# EAGLE board STM32 output card (EAGLE 9.5.1), part 1 of 2
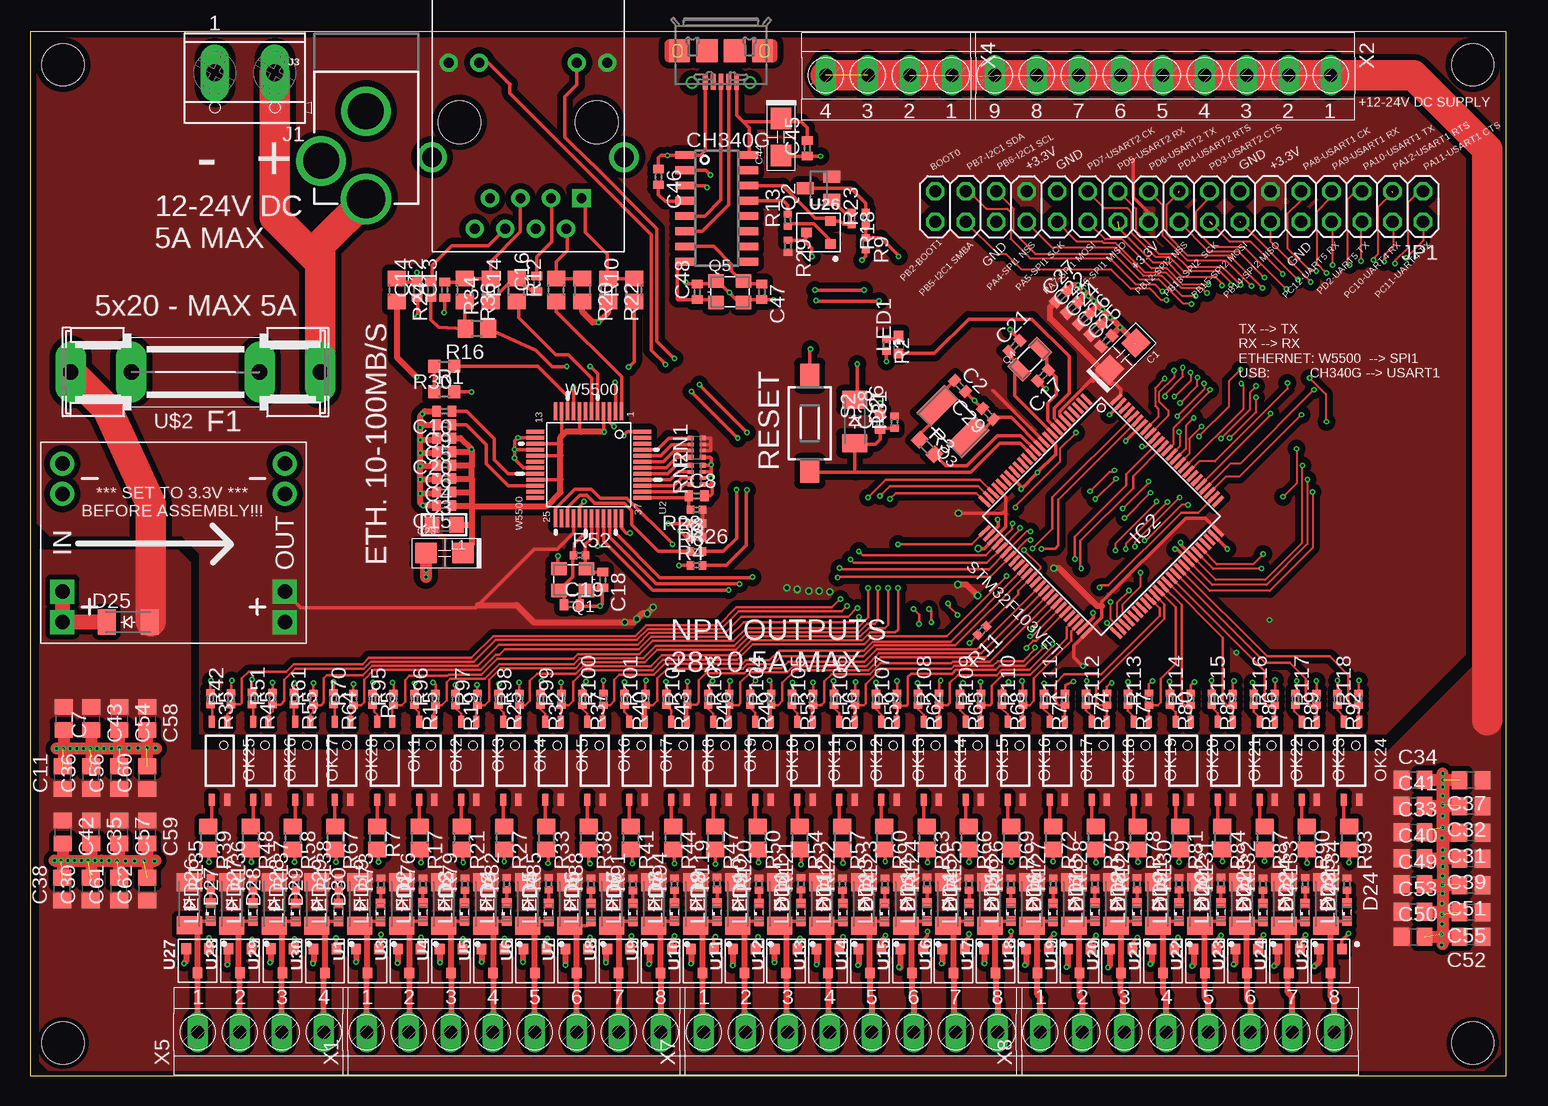
[diagram p7: board, top side]
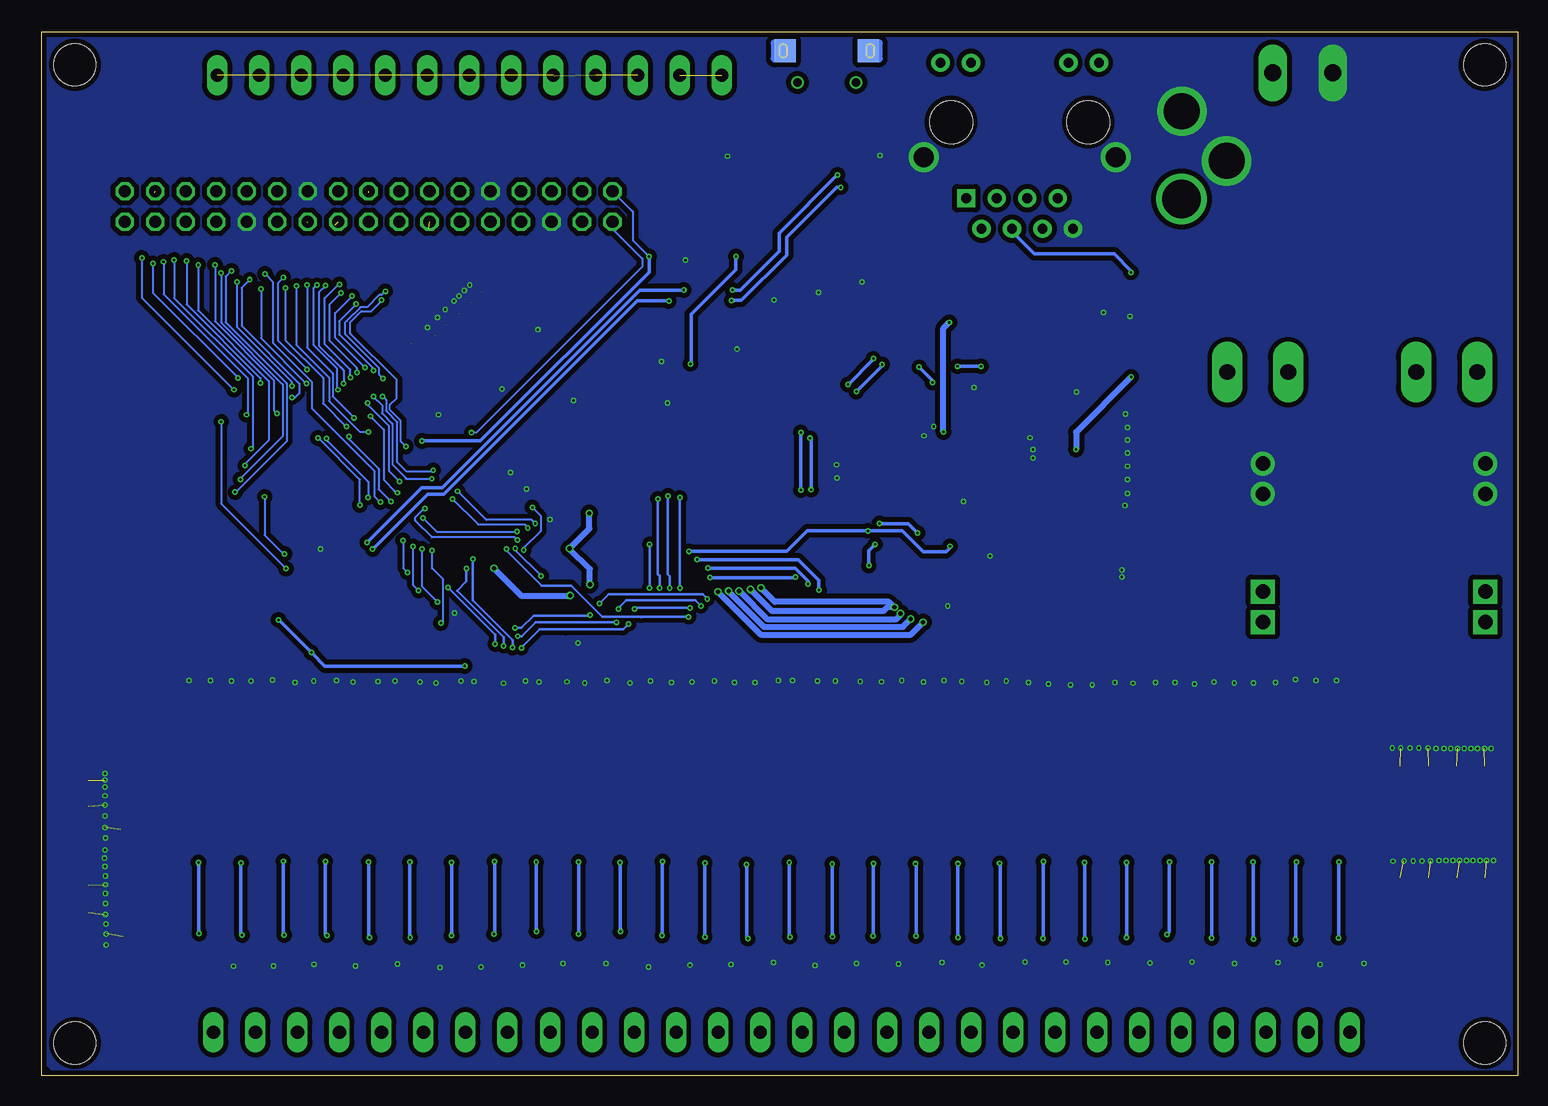
[diagram p8: board, bottom side, seen from below]

Size 123 x 87 mm. Coordinates in mm from the lower left corner, seen from the top.
Outline: 123,0 123,87 0,87 0,0 123,0
Copper layers (1*16): Top 0.035mm / dielectric 1.5mm / Bottom 0.035mm
Design rules "default *": minimum track width 5mil, minimum drill 0.2mm, track to track 5mil, track to pad 5mil, pad to pad 5mil, via to via 10mil, smd to smd 5mil, copper to edge 10mil, drill to drill 10mil, minimum pad ring 6mil, minimum via ring 5mil, stop-mask expansion 4mil, vias tented up to drill 20mil, thermal gap 6mil
Holes 3.5 mm at 120.24,84.25 2.75,84.25 2.74,2.74 120.24,2.74

## Footprints (pad centres in the part's own frame; a part is rotated, then mirrored left to right if it is on the bottom)
C-3216(TANTAL) = smd 1.8 x 1.7: 1 1.55,0; 2 -1.55,0
C0402 = smd 0.7 x 0.9: 1 -0.65,0; 2 0.65,0
C0805 = smd 1.3 x 1.5: 1 -0.95,0; 2 0.95,0
CON_USB_MICRO-B-3 = smd 1.73 x 1.9: B1 -3.463,-0.325; B4 3.463,-0.325 | smd 1.8 x 1.9: B2 -1.15,-0.325; B3 1.15,-0.325 | drill 0.7: B5 -2.425,2.325; B6 2.425,2.325 | smd 1.73 x 1.9 bottom: B7 -3.463,-0.325; B8 3.463,-0.325 | smd 0.4 x 1.35: P1 -1.3,2.25; P2 -0.65,2.25; P3 0,2.25; P4 0.65,2.25; P5 1.3,2.25
SOD-123_MINI-SMA = smd 1.5 x 2.1: A 1.8,0; C -1.8,0
SHK20L = drill 1.321 pad 2.54 long: 1A -10.414,0; 1B -5.334,0; 2A 10.414,0; 2B 5.334,0
LQFP100 = smd 0.3 x 1.2: 1 -6,-7.75; 2 -5.5,-7.75; 3 -5,-7.75; 4 -4.5,-7.75; 5 -4,-7.75; 6 -3.5,-7.75; 7 -3,-7.75; 8 -2.5,-7.75; 9 -2,-7.75; 10 -1.5,-7.75; 11 -1,-7.75; 12 -0.5,-7.75; 13 0,-7.75; 14 0.5,-7.75; 15 1,-7.75; 16 1.5,-7.75; 17 2,-7.75; 18 2.5,-7.75; 19 3,-7.75; 20 3.5,-7.75; 21 4,-7.75; 22 4.5,-7.75; 23 5,-7.75; 24 5.5,-7.75; 25 6,-7.75; 51 6,7.75; 52 5.5,7.75; 53 5,7.75; 54 4.5,7.75; 55 4,7.75; 56 3.5,7.75; 57 3,7.75; 58 2.5,7.75; 59 2,7.75; 60 1.5,7.75; 61 1,7.75; 62 0.5,7.75; 63 0,7.75; 64 -0.5,7.75; 65 -1,7.75; 66 -1.5,7.75; 67 -2,7.75; 68 -2.5,7.75; 69 -3,7.75; 70 -3.5,7.75; 71 -4,7.75; 72 -4.5,7.75; 73 -5,7.75; 74 -5.5,7.75; 75 -6,7.75 | smd 1.2 x 0.3: 26 7.75,-6; 27 7.75,-5.5; 28 7.75,-5; 29 7.75,-4.5; 30 7.75,-4; 31 7.75,-3.5; 32 7.75,-3; 33 7.75,-2.5; 34 7.75,-2; 35 7.75,-1.5; 36 7.75,-1; 37 7.75,-0.5; 38 7.75,0; 39 7.75,0.5; 40 7.75,1; 41 7.75,1.5; 42 7.75,2; 43 7.75,2.5; 44 7.75,3; 45 7.75,3.5; 46 7.75,4; 47 7.75,4.5; 48 7.75,5; 49 7.75,5.5; 50 7.75,6; 76 -7.75,6; 77 -7.75,5.5; 78 -7.75,5; 79 -7.75,4.5; 80 -7.75,4; 81 -7.75,3.5; 82 -7.75,3; 83 -7.75,2.5; 84 -7.75,2; 85 -7.75,1.5; 86 -7.75,1; 87 -7.75,0.5; 88 -7.75,0; 89 -7.75,-0.5; 90 -7.75,-1; 91 -7.75,-1.5; 92 -7.75,-2; 93 -7.75,-2.5; 94 -7.75,-3; 95 -7.75,-3.5; 96 -7.75,-4; 97 -7.75,-4.5; 98 -7.75,-5; 99 -7.75,-5.5; 100 -7.75,-6
TERMINAL_BLOCK_2P_5 = drill 1.4 pad 2.38 long: 1 2.5,-0.45; 2 -2.5,-0.45
RJ45 = drill 0.813 pad 1.524: G+ 4.953,-6.604; G- 4.953,-4.064; GND -8.89,4.445; NC -6.35,3.175; P4 -8.89,-0.635; P5 -6.35,0.635; RD+ -6.35,-1.905; RD- -8.89,1.905; TD- -8.89,-3.175; Y+ 4.953,6.604; Y- 4.953,4.064 | drill 1.651 pad 2.159: SHIELD0 -2.921,8.001; SHIELD1 -2.921,-8.001 | drill 0.813 pad 1.524 square: TD+ -6.35,-4.445 | hole 3.556: 0,-5.715; 0,5.715
POWER_JACK_PTH_LOCK = drill 2.997 pad 4.115: GND 0.025,6.557; GNDBREAK 3.762,10.7 | drill 3.2 pad 4.115: PWR 0,13.878
2X17 = drill 1.016 octagon: 1 -20.32,-1.27; 2 -20.32,1.27; 3 -17.78,-1.27; 4 -17.78,1.27; 5 -15.24,-1.27; 6 -15.24,1.27; 7 -12.7,-1.27; 8 -12.7,1.27; 9 -10.16,-1.27; 10 -10.16,1.27; 11 -7.62,-1.27; 12 -7.62,1.27; 13 -5.08,-1.27; 14 -5.08,1.27; 15 -2.54,-1.27; 16 -2.54,1.27; 17 0,-1.27; 18 0,1.27; 19 2.54,-1.27; 20 2.54,1.27; 21 5.08,-1.27; 22 5.08,1.27; 23 7.62,-1.27; 24 7.62,1.27; 25 10.16,-1.27; 26 10.16,1.27; 27 12.7,-1.27; 28 12.7,1.27; 29 15.24,-1.27; 30 15.24,1.27; 31 17.78,-1.27; 32 17.78,1.27; 33 20.32,-1.27; 34 20.32,1.27
L0805 = smd 1.2 x 1.3: 1 -1.016,0; 2 1.016,0
CHIP-LED0603 = smd 0.8 x 0.8: A 0,-0.75; C 0,0.75
SML0603 = smd 0.8 x 0.8: A 0.75,0; C -0.75,0
MINI-FLAT-4 = smd 1 x 0.5: 1 -3.24,0.635; 2 -3.24,-0.635; 3 3.24,-0.635; 4 3.24,0.635
3.2X2.5_KX-7 = smd 1.3 x 1.1: 1 -1.15,-0.9; 2 1.15,-0.9; 3 1.15,0.9; 4 -1.15,0.9
SOT23 = smd 1 x 1.4: 1 -0.95,-1.1; 2 0.95,-1.1; 3 0,1.1
5.0X3.2_2 = smd 1.7 x 3.3: 1 -1.85,0; 2 1.85,0
3.2X1.5 = smd 1 x 1.8: 1 -1.25,0; 2 1.25,0
R0603 = smd 1 x 1.1: 1 -0.85,0; 2 0.85,0
R0402 = smd 0.6 x 0.7: 1 -0.5,0; 2 0.5,0
R0805 = smd 1.3 x 1.5: 1 -0.95,0; 2 0.95,0
4X0402ARV341 = smd 0.4 x 0.5: 1 -0.8,-0.5; 4 0.8,-0.5; 5 0.8,0.5; 8 -0.8,0.5 | smd 0.3 x 0.5: 2 -0.25,-0.5; 3 0.25,-0.5; 6 0.25,0.5; 7 -0.25,0.5
DTSM-3 = smd 2 x 1.6: 1 -3.97,0; 2 3.97,0
SOT-23-3 = smd 0.9 x 0.8: P$1 -1,0.95; P$2 -1,-0.95; P$3 1,0
W5500 = smd 1.5 x 0.3: 1 -4.45,2.75; 2 -4.45,2.25; 3 -4.45,1.75; 4 -4.45,1.25; 5 -4.45,0.75; 6 -4.45,0.25; 7 -4.45,-0.25; 8 -4.45,-0.75; 9 -4.45,-1.25; 10 -4.45,-1.75; 11 -4.45,-2.25; 12 -4.45,-2.75; 25 4.45,-2.75; 26 4.45,-2.25; 27 4.45,-1.75; 28 4.45,-1.25; 29 4.45,-0.75; 30 4.45,-0.25; 31 4.45,0.25; 32 4.45,0.75; 33 4.45,1.25; 34 4.45,1.75; 35 4.45,2.25; 36 4.45,2.75 | smd 0.3 x 1.5: 13 -2.75,-4.45; 14 -2.25,-4.45; 15 -1.75,-4.45; 16 -1.25,-4.45; 17 -0.75,-4.45; 18 -0.25,-4.45; 19 0.25,-4.45; 20 0.75,-4.45; 21 1.25,-4.45; 22 1.75,-4.45; 23 2.25,-4.45; 24 2.75,-4.45; 37 2.75,4.45; 38 2.25,4.45; 39 1.75,4.45; 40 1.25,4.45; 41 0.75,4.45; 42 0.25,4.45; 43 -0.25,4.45; 44 -0.75,4.45; 45 -1.25,4.45; 46 -1.75,4.45; 47 -2.25,4.45; 48 -2.75,4.45
SOIC16 = smd 0.635 x 1.524: 1 -4.445,-2.695; 2 -3.175,-2.695; 3 -1.905,-2.695; 4 -0.635,-2.695; 5 0.635,-2.695; 6 1.905,-2.695; 7 3.175,-2.695; 8 4.445,-2.695; 9 4.445,2.695; 10 3.175,2.695; 11 1.905,2.695; 12 0.635,2.695; 13 -0.635,2.695; 14 -1.905,2.695; 15 -3.175,2.695; 16 -4.445,2.695
DC-DC-STEP-DOWN-MP1584 = drill 1.2 pad 2 square: IN+.1 -9.271,-4.064; IN+.2 -9.271,-6.604; OUT+.1 9.271,-4.064; OUT+.2 9.271,-6.604 | drill 1.2 pad 2: IN-.1 -9.271,6.604; IN-.2 -9.271,4.064; OUT-.1 9.271,6.604; OUT-.2 9.271,4.064
TERMINAL-BLOCK-8-PIN-3.5MM-LONG-PAD = drill 1.1 pad 1.7 long: 1 -12.25,-0.1; 2 -8.75,-0.1; 3 -5.25,-0.1; 4 -1.75,-0.1; 5 1.75,-0.1; 6 5.25,-0.1; 7 8.75,-0.1; 8 12.25,-0.1
TERMINAL-BLOCK-9-PIN-3.5MM-LONG-PAD = drill 1.1 pad 1.7 long: 1 -13.973,-0.1; 2 -10.473,-0.1; 3 -6.973,-0.1; 4 -3.473,-0.1; 5 0.028,-0.1; 6 3.527,-0.1; 7 7.027,-0.1; 8 10.527,-0.1; 9 14.027,-0.1
TERMINAL-BLOCK-4-PIN-3.5MM-LONG-PAD = drill 1.1 pad 1.7 long: 1 -5.25,-0.1; 2 -1.75,-0.1; 3 1.75,-0.1; 4 5.25,-0.1

## Placement (x,y rotation side)
C1  10uF/16V  [C-3216(TANTAL)]  91.06,59.97 225 top
C2  20pF  [C0402]  77.5,57.48 315 top
C3  100nF  [C0402]  34.52,48.65 180 top
C4  100nF  [C0402]  34.52,49.77 180 top
C5  100nF  [C0402]  34.52,53.14 180 top
C6  100nF  [C0402]  34.52,50.9 180 top
C7  470nF - 50V  [C0805]  2.79,29.78 270 top
C8  100nF  [C0402]  55.55,48.33 0 top
C9  10nF  [C0402]  34.52,54.26 180 top
C10  4.7µF  [C0402]  34.52,55.39 180 top
C11  470nF - 50V  [C0805]  2.74,24.85 90 top
C12  6.8nF  [C0402]  33.4,65.49 90 top
C13  10nF  [C0402]  34.56,65.49 90 top
C14  22nF  [C0402]  32.24,65.49 90 top
C15  100nF  [C0402]  34.52,47.53 180 top
C16  6.8nF  [C0402]  42.23,66 90 top
C17  10pF  [C0402]  84.43,58.37 225 top
C18  18pF  [C0402]  47.73,41.33 270 top
C19  18pF  [C0402]  45.16,39.27 0 top
C20  100nF  [C0402]  34.52,52.02 180 top
C21  10pF  [C0402]  82.04,60.83 45 top
C22  100nF  [C0402]  86.85,64.01 45 top
C23  10uF/16V  [C-3216(TANTAL)]  34.54,43.56 0 top
C24  100nF  [C0402]  87.84,63.08 45 top
C25  100nF  [C0402]  89.69,61.24 45 top
C26  100nF  [C0402]  88.78,62.17 45 top
C27  100nF  [C0402]  85.93,64.94 45 top
C28  1µF  [C0402]  70.84,54.51 90 top
C29  20pF  [C0402]  79.83,55.17 135 top
C30  470nF - 50V  [C0805]  5.05,15.56 90 top
C31  470nF - 50V  [C0805]  120.08,20.27 180 top
C32  470nF - 50V  [C0805]  120.08,22.45 180 top
C33  470nF - 50V  [C0805]  115.26,20.32 0 top
C34  470nF - 50V  [C0805]  115.26,24.69 0 top
C35  470nF - 50V  [C0805]  5.09,20.33 270 top
C36  470nF - 50V  [C0805]  5.09,24.85 90 top
C37  470nF - 50V  [C0805]  120.08,24.64 180 top
C38  470nF - 50V  [C0805]  2.69,15.56 90 top
C39  470nF - 50V  [C0805]  120.08,18.08 180 top
C40  470nF - 50V  [C0805]  115.26,18.14 0 top
C41  470nF - 50V  [C0805]  115.26,22.5 0 top
C42  470nF - 50V  [C0805]  2.74,20.33 270 top
C43  470nF - 50V  [C0805]  5.12,29.78 270 top
C44  10uF/16V  [C-3216(TANTAL)]  62.59,78.23 90 top
C45  100pF  [C0402]  64.77,77.29 90 top
C46  100pF  [C0402]  52.37,74.9 270 top
C47  22pF  [C0402]  60.99,65.34 270 top
C48  22pF  [C0402]  55.6,65.34 90 top
C49  470nF - 50V  [C0805]  115.26,15.95 0 top
C50  470nF - 50V  [C0805]  115.26,11.58 0 top
C51  470nF - 50V  [C0805]  120.08,15.88 180 top
C52  470nF - 50V  [C0805]  120.08,11.58 180 top
C53  470nF - 50V  [C0805]  115.26,13.69 0 top
C54  470nF - 50V  [C0805]  7.45,29.78 270 top
C55  470nF - 50V  [C0805]  120.08,13.61 180 top
C56  470nF - 50V  [C0805]  7.43,24.85 90 top
C57  470nF - 50V  [C0805]  7.43,20.33 270 top
C58  470nF - 50V  [C0805]  9.78,29.78 270 top
C59  470nF - 50V  [C0805]  9.78,20.33 270 top
C60  470nF - 50V  [C0805]  9.78,24.85 90 top
C61  470nF - 50V  [C0805]  7.42,15.56 90 top
C62  470nF - 50V  [C0805]  9.78,15.56 90 top
CONN1  CON-USB-F-MICRO-B-2-SD-47589-001_ALIKE  [CON_USB_MICRO-B-3]  57.58,85.09 180 top
D1  CGRM4007-G  [SOD-123_MINI-SMA]  27.48,14.32 270 top
D2  CGRM4007-G  [SOD-123_MINI-SMA]  30.98,14.32 270 top
D3  CGRM4007-G  [SOD-123_MINI-SMA]  34.48,14.32 270 top
D4  CGRM4007-G  [SOD-123_MINI-SMA]  37.99,14.32 270 top
D5  CGRM4007-G  [SOD-123_MINI-SMA]  41.49,14.32 270 top
D6  CGRM4007-G  [SOD-123_MINI-SMA]  44.99,14.32 270 top
D7  CGRM4007-G  [SOD-123_MINI-SMA]  48.49,14.32 270 top
D8  CGRM4007-G  [SOD-123_MINI-SMA]  51.99,14.32 270 top
D9  CGRM4007-G  [SOD-123_MINI-SMA]  55.49,14.32 270 top
D10  CGRM4007-G  [SOD-123_MINI-SMA]  58.99,14.32 270 top
D11  CGRM4007-G  [SOD-123_MINI-SMA]  62.49,14.32 270 top
D12  CGRM4007-G  [SOD-123_MINI-SMA]  65.99,14.32 270 top
D13  CGRM4007-G  [SOD-123_MINI-SMA]  69.49,14.32 270 top
D14  CGRM4007-G  [SOD-123_MINI-SMA]  72.99,14.32 270 top
D15  CGRM4007-G  [SOD-123_MINI-SMA]  76.49,14.32 270 top
D16  CGRM4007-G  [SOD-123_MINI-SMA]  79.99,14.32 270 top
D17  CGRM4007-G  [SOD-123_MINI-SMA]  83.5,14.32 270 top
D18  CGRM4007-G  [SOD-123_MINI-SMA]  87,14.32 270 top
D19  CGRM4007-G  [SOD-123_MINI-SMA]  90.5,14.32 270 top
D20  CGRM4007-G  [SOD-123_MINI-SMA]  94,14.32 270 top
D21  CGRM4007-G  [SOD-123_MINI-SMA]  97.5,14.32 270 top
D22  CGRM4007-G  [SOD-123_MINI-SMA]  101,14.32 270 top
D23  CGRM4007-G  [SOD-123_MINI-SMA]  104.5,14.32 270 top
D24  CGRM4007-G  [SOD-123_MINI-SMA]  108,14.32 270 top
D25  CGRM4007-G  [SOD-123_MINI-SMA]  8.18,37.82 0 top
D26  CGRM4007-G  [SOD-123_MINI-SMA]  68.73,54.53 270 top
D27  CGRM4007-G  [SOD-123_MINI-SMA]  13.28,14.35 270 top
D28  CGRM4007-G  [SOD-123_MINI-SMA]  16.81,14.33 270 top
D29  CGRM4007-G  [SOD-123_MINI-SMA]  20.35,14.33 270 top
D30  CGRM4007-G  [SOD-123_MINI-SMA]  23.9,14.33 270 top
F1  FUSESHK20L  [SHK20L]  13.79,58.65 180 top
IC2  STM32F103VET  [LQFP100]  89.28,46.63 225 top
J1  CON_TERMINAL_BLOCK_02-5MM  [TERMINAL_BLOCK_2P_5]  17.91,83.13 180 top
J2  [RJ45]  41.5,79.48 90 top
J3  POWER_JACKPTH_LOCK  [POWER_JACK_PTH_LOCK]  28.02,86.94 180 top
JP1  [2X17]  95.76,72.44 180 top
L1  GZ2012D101TF  [L0805]  34.52,45.92 180 top
LED1  [CHIP-LED0603]  72.39,60.96 0 top
LED2  [SML0603]  32.74,13.64 90 top
LED3  [SML0603]  36.22,13.64 90 top
LED4  [SML0603]  39.73,13.64 90 top
LED5  [SML0603]  43.23,13.61 90 top
LED6  [SML0603]  46.74,13.61 90 top
LED7  [SML0603]  50.24,13.61 90 top
LED8  [SML0603]  53.72,13.64 90 top
LED9  [SML0603]  57.25,13.64 90 top
LED10  [SML0603]  60.76,13.61 90 top
LED11  [SML0603]  64.24,13.61 90 top
LED12  [SML0603]  67.74,13.61 90 top
LED13  [SML0603]  71.22,13.61 90 top
LED14  [SML0603]  74.75,13.64 90 top
LED15  [SML0603]  78.26,13.61 90 top
LED16  [SML0603]  81.74,13.64 90 top
LED17  [SML0603]  85.24,13.61 90 top
LED18  [SML0603]  88.75,13.64 90 top
LED19  [SML0603]  29.21,13.61 90 top
LED20  [SML0603]  92.25,13.64 90 top
LED21  [SML0603]  95.76,13.64 90 top
LED22  [SML0603]  99.24,13.64 90 top
LED23  [SML0603]  102.74,13.61 90 top
LED24  [SML0603]  106.25,13.61 90 top
LED25  [SML0603]  109.75,13.64 90 top
LED26  [SML0603]  15.06,13.64 90 top
LED27  [SML0603]  18.59,13.64 90 top
LED28  [SML0603]  22.15,13.61 90 top
LED29  [SML0603]  25.7,13.61 90 top
OK1  JC3H7C  [MINI-FLAT-4]  29.57,26.25 270 top
OK2  JC3H7C  [MINI-FLAT-4]  33.07,26.25 270 top
OK3  JC3H7C  [MINI-FLAT-4]  36.57,26.25 270 top
OK4  JC3H7C  [MINI-FLAT-4]  40.07,26.25 270 top
OK5  JC3H7C  [MINI-FLAT-4]  43.57,26.25 270 top
OK6  JC3H7C  [MINI-FLAT-4]  47.08,26.25 270 top
OK7  JC3H7C  [MINI-FLAT-4]  50.58,26.25 270 top
OK8  JC3H7C  [MINI-FLAT-4]  54.08,26.25 270 top
OK9  JC3H7C  [MINI-FLAT-4]  57.58,26.25 270 top
OK10  JC3H7C  [MINI-FLAT-4]  61.09,26.25 270 top
OK11  JC3H7C  [MINI-FLAT-4]  64.59,26.25 270 top
OK12  JC3H7C  [MINI-FLAT-4]  68.09,26.25 270 top
OK13  JC3H7C  [MINI-FLAT-4]  71.59,26.25 270 top
OK14  JC3H7C  [MINI-FLAT-4]  75.09,26.25 270 top
OK15  JC3H7C  [MINI-FLAT-4]  78.6,26.25 270 top
OK16  JC3H7C  [MINI-FLAT-4]  82.1,26.25 270 top
OK17  JC3H7C  [MINI-FLAT-4]  85.6,26.25 270 top
OK18  JC3H7C  [MINI-FLAT-4]  89.1,26.25 270 top
OK19  JC3H7C  [MINI-FLAT-4]  92.6,26.25 270 top
OK20  JC3H7C  [MINI-FLAT-4]  96.11,26.25 270 top
OK21  JC3H7C  [MINI-FLAT-4]  99.61,26.25 270 top
OK22  JC3H7C  [MINI-FLAT-4]  103.11,26.25 270 top
OK23  JC3H7C  [MINI-FLAT-4]  106.61,26.25 270 top
OK24  JC3H7C  [MINI-FLAT-4]  110.12,26.25 270 top
OK25  JC3H7C  [MINI-FLAT-4]  15.8,26.26 270 top
OK26  JC3H7C  [MINI-FLAT-4]  19.23,26.26 270 top
OK27  JC3H7C  [MINI-FLAT-4]  22.73,26.26 270 top
OK28  JC3H7C  [MINI-FLAT-4]  26.04,26.26 270 top
Q1  25MHz  [3.2X2.5_KX-7]  45.24,41.35 180 top
Q2  S9012  [SOT23]  65.72,73.96 90 top
Q3  8MHz  [5.0X3.2_2]  76.91,54.53 135 top
Q4  32.768KHz  [3.2X1.5]  83.31,59.72 45 top
Q5  12MHz  [3.2X2.5_KX-7]  58.32,65.34 0 top
R1  6.2K  [R0603]  34.52,57.01 0 top
R2  510R  [R0402]  71.37,60.91 270 top
R3  390R  [R0603]  74.75,52.4 315 top
R4  10K  [R0402]  55.55,44.86 180 top
R5  680 Ohm  [R0402]  28.55,31.39 270 top
R6  10K  [R0402]  55.55,46.02 180 top
R7  3K  [R0805]  28.94,19.82 270 top
R8  10K  [R0402]  55.55,47.17 180 top
R9  100K  [R0402]  69.65,69.34 270 top
R10  33R  [R0805]  50.34,65.49 90 top
R11  100K  [R0402]  79.35,37.11 225 top
R12  33R  [R0805]  43.86,65.49 90 top
R13  1K  [R0402]  63.14,71.3 90 top
R14  33R  [R0805]  40.54,65.49 90 top
R15  680 Ohm  [R0402]  32.05,31.39 270 top
R16  33R  [R0805]  37.24,62.26 180 top
R17  3K  [R0805]  32.46,19.82 270 top
R18  1K  [R0402]  68.48,71.45 270 top
R19  680 Ohm  [R0402]  35.45,31.37 270 top
R20  49R9  [R0805]  46.02,65.49 270 top
R21  3K  [R0805]  35.99,19.82 270 top
R22  49R9  [R0805]  48.18,65.49 270 top
R23  1K  [R0402]  69.65,71.45 90 top
R24  49R9  [R0805]  30.58,65.49 270 top
R25  680 Ohm  [R0402]  39.04,31.39 270 top
R26  330R  [R0402]  55.55,43.7 0 top
R27  3K  [R0805]  39.51,19.82 270 top
R28  330R  [R0402]  55.55,42.55 0 top
R29  10K  [R0402]  63.17,69.14 270 top
R30  6.2K  [R0603]  34.52,59.13 180 top
R31  10K  [R0402]  72.03,54.46 90 top
R32  680 Ohm  [R0402]  42.54,31.39 270 top
R33  3K  [R0805]  43.03,19.82 270 top
R34  49R9  [R0805]  38.38,65.49 270 top
R35  680 Ohm  [R0402]  15.04,31.42 270 top
R36  49R9  [R0805]  36.22,65.49 270 top
R37  680 Ohm  [R0402]  46.03,31.39 270 top
R38  3K  [R0805]  46.55,19.82 270 top
R39  3K  [R0805]  14.86,19.82 270 top
R40  680 Ohm  [R0402]  49.53,31.39 270 top
R41  3K  [R0805]  50.07,19.82 270 top
R42  100K  [R0402]  16.76,31.42 90 top
R43  680 Ohm  [R0402]  53.03,31.39 270 top
R44  3K  [R0805]  53.59,19.82 270 top
R45  680 Ohm  [R0402]  18.49,31.45 270 top
R46  680 Ohm  [R0402]  56.52,31.39 270 top
R47  3K  [R0805]  57.11,19.82 270 top
R48  3K  [R0805]  18.38,19.82 270 top
R49  680 Ohm  [R0402]  60.02,31.39 270 top
R50  3K  [R0805]  60.63,19.82 270 top
R51  100K  [R0402]  20.22,31.45 90 top
R52  1M  [R0402]  45.79,43.38 0 top
R53  680 Ohm  [R0402]  63.52,31.39 270 top
R54  3K  [R0805]  64.16,19.82 270 top
R55  680 Ohm  [R0402]  22,31.45 270 top
R56  680 Ohm  [R0402]  67.01,31.39 270 top
R57  3K  [R0805]  67.68,19.82 270 top
R58  3K  [R0805]  21.9,19.82 270 top
R59  680 Ohm  [R0402]  70.51,31.39 270 top
R60  3K  [R0805]  71.2,19.82 270 top
R61  100K  [R0402]  23.62,31.39 90 top
R62  680 Ohm  [R0402]  74,31.39 270 top
R63  3K  [R0805]  74.72,19.82 270 top
R64  680 Ohm  [R0402]  25.3,31.42 270 top
R65  680 Ohm  [R0402]  77.5,31.39 270 top
R66  3K  [R0805]  78.24,19.82 270 top
R67  3K  [R0805]  25.42,19.82 270 top
R68  680 Ohm  [R0402]  81,31.39 270 top
R69  3K  [R0805]  81.76,19.82 270 top
R70  100K  [R0402]  26.97,31.39 90 top
R71  680 Ohm  [R0402]  84.49,31.39 270 top
R72  3K  [R0805]  85.28,19.82 270 top
R73  6.8K  [R0402]  29.24,15.96 90 top
R74  680 Ohm  [R0402]  87.99,31.39 270 top
R75  3K  [R0805]  88.8,19.82 270 top
R76  6.8K  [R0402]  32.74,15.98 90 top
R77  680 Ohm  [R0402]  91.49,31.39 270 top
R78  3K  [R0805]  92.33,19.82 270 top
R79  6.8K  [R0402]  36.25,15.98 90 top
R80  680 Ohm  [R0402]  94.98,31.39 270 top
R81  3K  [R0805]  95.85,19.82 270 top
R82  6.8K  [R0402]  39.73,16 90 top
R83  680 Ohm  [R0402]  98.48,31.39 270 top
R84  3K  [R0805]  99.37,19.82 270 top
R85  6.8K  [R0402]  43.23,16 90 top
R86  680 Ohm  [R0402]  101.98,31.39 270 top
R87  3K  [R0805]  102.89,19.82 270 top
R88  6.8K  [R0402]  46.74,15.98 90 top
R89  680 Ohm  [R0402]  105.47,31.39 270 top
R90  3K  [R0805]  106.41,19.82 270 top
R91  6.8K  [R0402]  50.24,15.95 90 top
R92  680 Ohm  [R0402]  108.97,31.39 270 top
R93  3K  [R0805]  109.93,19.82 270 top
R94  6.8K  [R0402]  53.72,15.98 90 top
R95  100K  [R0402]  30.3,31.39 90 top
R96  100K  [R0402]  33.79,31.39 90 top
R97  100K  [R0402]  37.29,31.39 90 top
R98  100K  [R0402]  40.79,31.39 90 top
R99  100K  [R0402]  44.28,31.39 90 top
R100  100K  [R0402]  47.78,31.39 90 top
R101  100K  [R0402]  51.28,31.39 90 top
R102  100K  [R0402]  54.77,31.39 90 top
R103  100K  [R0402]  58.27,31.39 90 top
R104  100K  [R0402]  61.77,31.39 90 top
R105  100K  [R0402]  65.26,31.39 90 top
R106  100K  [R0402]  68.76,31.39 90 top
R107  100K  [R0402]  72.26,31.39 90 top
R108  100K  [R0402]  75.75,31.39 90 top
R109  100K  [R0402]  79.25,31.39 90 top
R110  100K  [R0402]  82.75,31.39 90 top
R111  100K  [R0402]  86.24,31.39 90 top
R112  100K  [R0402]  89.74,31.39 90 top
R113  100K  [R0402]  93.24,31.39 90 top
R114  100K  [R0402]  96.73,31.39 90 top
R115  100K  [R0402]  100.23,31.39 90 top
R116  100K  [R0402]  103.73,31.39 90 top
R117  100K  [R0402]  107.22,31.39 90 top
R118  100K  [R0402]  110.72,31.39 90 top
R119  6.8K  [R0402]  57.25,16.03 90 top
R120  6.8K  [R0402]  60.76,15.98 90 top
R121  6.8K  [R0402]  64.24,16 90 top
R122  6.8K  [R0402]  67.72,15.98 90 top
R123  6.8K  [R0402]  71.25,15.98 90 top
R124  6.8K  [R0402]  74.75,16.03 90 top
R125  6.8K  [R0402]  78.26,15.98 90 top
R126  6.8K  [R0402]  81.74,15.98 90 top
R127  6.8K  [R0402]  85.27,15.98 90 top
R128  6.8K  [R0402]  88.75,16 90 top
R129  6.8K  [R0402]  92.25,16 90 top
R130  6.8K  [R0402]  95.76,16 90 top
R131  6.8K  [R0402]  99.24,16.03 90 top
R132  6.8K  [R0402]  102.74,15.98 90 top
R133  6.8K  [R0402]  106.27,16 90 top
R134  6.8K  [R0402]  109.75,15.98 90 top
R135  6.8K  [R0402]  15.06,16 90 top
R136  6.8K  [R0402]  18.59,15.98 90 top
R137  6.8K  [R0402]  22.15,16 90 top
R138  6.8K  [R0402]  25.73,16 90 top
RN1  10K  [4X0402ARV341]  55.55,52.35 270 top
RN2  10K  [4X0402ARV341]  55.55,50.08 270 top
S2  DTSM-3  [DTSM-3]  64.97,54.38 270 top
U1  S9013  [SOT-23-3]  28.12,9.58 270 top
U2  W5500  [W5500]  46.56,50.93 270 top
U3  NPN BJT S9013  [SOT-23-3]  31.61,9.58 270 top
U4  NPN BJT S9013  [SOT-23-3]  35.1,9.58 270 top
U5  NPN BJT S9013  [SOT-23-3]  38.59,9.58 270 top
U6  NPN BJT S9013  [SOT-23-3]  42.08,9.58 270 top
U7  NPN BJT S9013  [SOT-23-3]  45.57,9.58 270 top
U8  NPN BJT S9013  [SOT-23-3]  49.06,9.58 270 top
U9  NPN BJT S9013  [SOT-23-3]  52.55,9.58 270 top
U10  NPN BJT S9013  [SOT-23-3]  56.04,9.58 270 top
U11  NPN BJT S9013  [SOT-23-3]  59.53,9.58 270 top
U12  NPN BJT S9013  [SOT-23-3]  63.02,9.58 270 top
U13  NPN BJT S9013  [SOT-23-3]  66.5,9.58 270 top
U14  NPN BJT S9013  [SOT-23-3]  69.99,9.58 270 top
U15  NPN BJT S9013  [SOT-23-3]  73.48,9.58 270 top
U16  NPN BJT S9013  [SOT-23-3]  76.97,9.58 270 top
U17  NPN BJT S9013  [SOT-23-3]  80.46,9.58 270 top
U18  NPN BJT S9013  [SOT-23-3]  83.95,9.58 270 top
U19  NPN BJT S9013  [SOT-23-3]  87.44,9.58 270 top
U20  NPN BJT S9013  [SOT-23-3]  90.93,9.58 270 top
U21  NPN BJT S9013  [SOT-23-3]  94.42,9.58 270 top
U22  NPN BJT S9013  [SOT-23-3]  97.91,9.58 270 top
U23  NPN BJT S9013  [SOT-23-3]  101.4,9.58 270 top
U24  NPN BJT S9013  [SOT-23-3]  104.89,9.58 270 top
U25  NPN BJT S9013  [SOT-23-3]  108.38,9.58 270 top
U26  NPN BJT S9013  [SOT-23-3]  65.72,70.28 180 top
U27  NPN BJT S9013  [SOT-23-3]  13.97,9.6 270 top
U28  NPN BJT S9013  [SOT-23-3]  17.5,9.6 270 top
U29  NPN BJT S9013  [SOT-23-3]  21.03,9.6 270 top
U30  NPN BJT S9013  [SOT-23-3]  24.59,9.58 270 top
U$1  CH340G  [SOIC16]  57.23,72.29 270 top
U$2  DC-DC-STEP-DOWN-MP1584  [DC-DC-STEP-DOWN-MP1584]  11.96,44.42 0 top
X1  TERMINAL-BLOCK-3.5MM-8-PIN-LONG-PAD  [TERMINAL-BLOCK-8-PIN-3.5MM-LONG-PAD]  40.31,3.73 0 top
X2  TERMINAL-BLOCK-3.5MM-9-PIN-LONG-PAD  [TERMINAL-BLOCK-9-PIN-3.5MM-LONG-PAD]  94.41,83.29 180 top
X4  TERMINAL-BLOCK-3.5MM-4-PIN-LONG-PAD  [TERMINAL-BLOCK-4-PIN-3.5MM-LONG-PAD]  71.58,83.29 180 top
X5  TERMINAL-BLOCK-3.5MM-4-PIN-LONG-PAD  [TERMINAL-BLOCK-4-PIN-3.5MM-LONG-PAD]  19.23,3.73 0 top
X7  TERMINAL-BLOCK-3.5MM-8-PIN-LONG-PAD  [TERMINAL-BLOCK-8-PIN-3.5MM-LONG-PAD]  68.38,3.73 0 top
X8  TERMINAL-BLOCK-3.5MM-8-PIN-LONG-PAD  [TERMINAL-BLOCK-8-PIN-3.5MM-LONG-PAD]  96.44,3.73 0 top